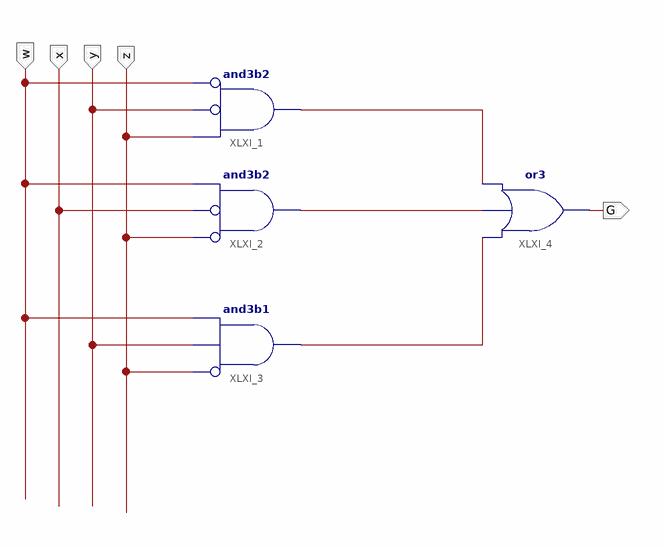
[diagram p0: schematic sheet 1]
// Xilinx ISE schematic sche2.sch (xc9500xl) as structural Verilog: 4 symbols, 5 ports
module sche2 (
  input  w,
  input  x,
  input  y,
  input  z,
  output G
);

  wire XLXN_8, XLXN_9, XLXN_10;

  and XLXI_1 (XLXN_8, ~w, ~y, z);  // and3b2
  and XLXI_2 (XLXN_9, ~z, ~x, w);  // and3b2
  and XLXI_3 (XLXN_10, ~z, y, w);  // and3b1
  or XLXI_4 (G, XLXN_10, XLXN_9, XLXN_8);
endmodule
